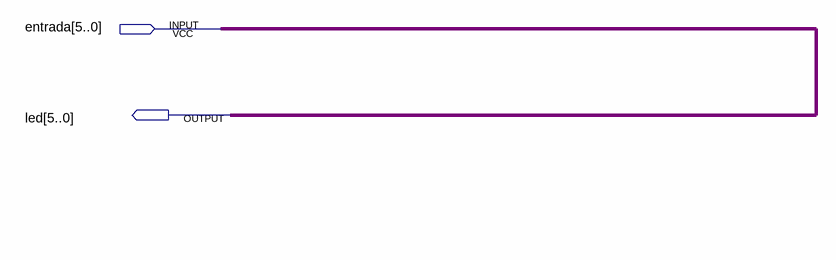
[diagram p0: schematic sheet]
// Quartus schematic moduloLED.bdf as structural Verilog: 0 symbols, 2 pins
module moduloLED (
  input  [5:0] entrada,
  output [5:0] led
);


  assign led = entrada;
endmodule
